# EAGLE schematic Entrance v0.2 (EAGLE 9.6.2)
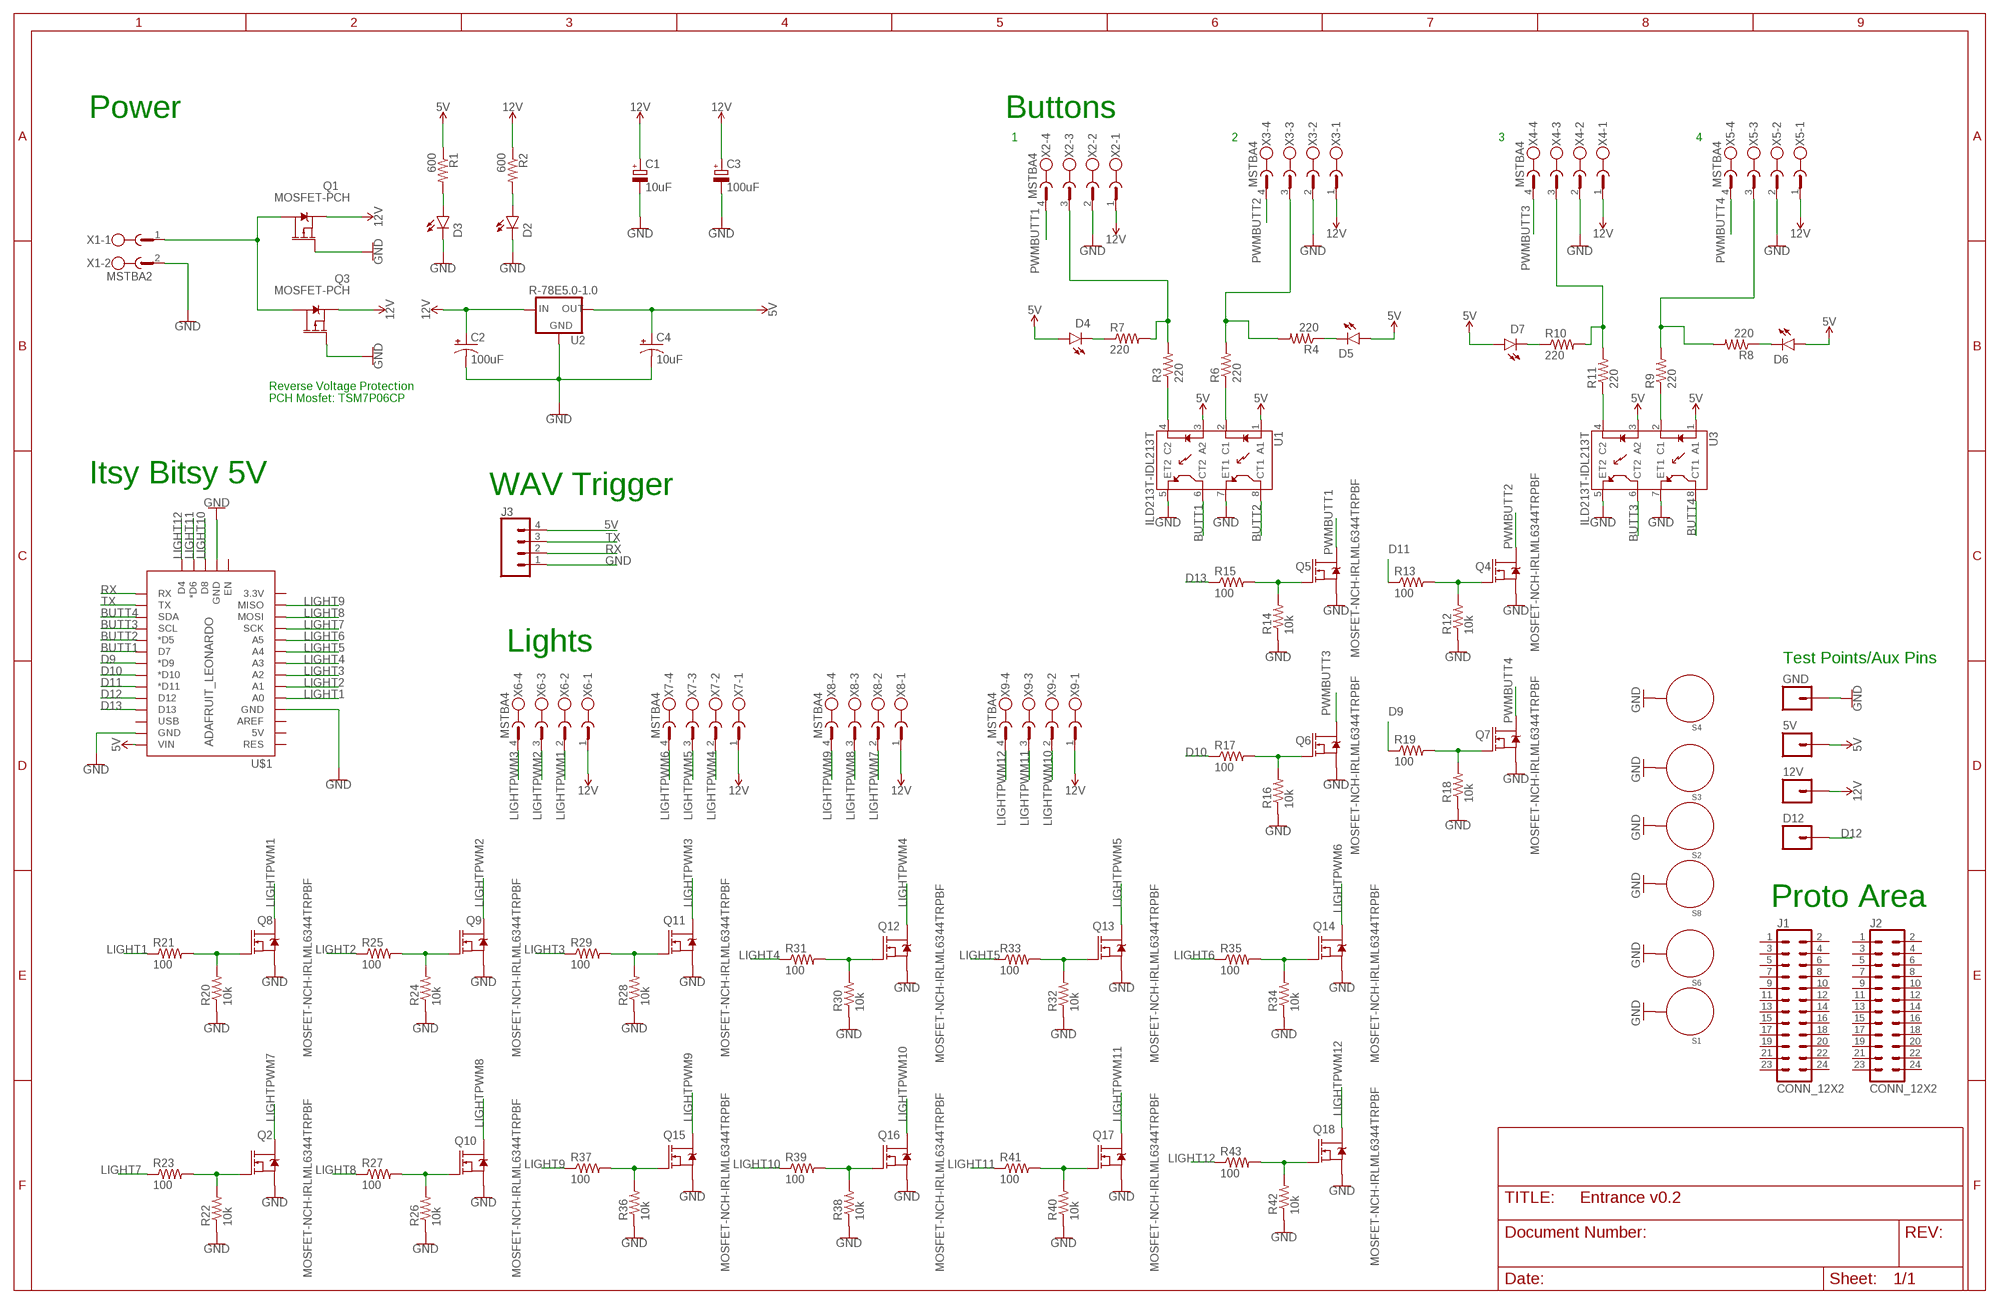
[diagram p0: schematic, sheet 1]

## Parts
5V  M01PTH  [1X01]
12V  M01PTH  [1X01]
C1  10uF  CPOL-EUE2-5  [E2-5]
C2  100uF  100UF-POLAR-RADIAL-2.5MM-25V-20%  [CPOL-RADIAL-2.5MM-6.5MM]
C3  100uF  CPOL-EUE3.5-10  [E3,5-10]
C4  10uF  10UF-POLAR-RADIAL-2.5MM-KIT-25V-20%  [CPOL-RADIAL-2.5MM-5MM-KIT]
D2  RED  SPARKFUN-LED_LED1206  [SPARKFUN-LED_LED-1206]
D3  RED  SPARKFUN-LED_LED1206  [SPARKFUN-LED_LED-1206]
D4  RED  LED-RED1206  [LED-1206]
D5  RED  LED-RED1206  [LED-1206]
D6  RED  LED-RED1206  [LED-1206]
D7  RED  LED-RED1206  [LED-1206]
D12  M01PTH  [1X01]
GND  M01PTH  [1X01]
J1  CONN_12X2  [2X12]
J2  CONN_12X2  [2X12]
J3  CONN_043.5MM_RA  [1X04_3.5MM_RA]
Q1  MOSFET-PCH  [DPAK@1]
Q2  MOSFET-NCH-IRLML6344TRPBF  [SOT23-3]
Q3  MOSFET-PCH  [DPAK@1]
Q4  MOSFET-NCH-IRLML6344TRPBF  [SOT23-3]
Q5  MOSFET-NCH-IRLML6344TRPBF  [SOT23-3]
Q6  MOSFET-NCH-IRLML6344TRPBF  [SOT23-3]
Q7  MOSFET-NCH-IRLML6344TRPBF  [SOT23-3]
Q8  MOSFET-NCH-IRLML6344TRPBF  [SOT23-3]
Q9  MOSFET-NCH-IRLML6344TRPBF  [SOT23-3]
Q10  MOSFET-NCH-IRLML6344TRPBF  [SOT23-3]
Q11  MOSFET-NCH-IRLML6344TRPBF  [SOT23-3]
Q12  MOSFET-NCH-IRLML6344TRPBF  [SOT23-3]
Q13  MOSFET-NCH-IRLML6344TRPBF  [SOT23-3]
Q14  MOSFET-NCH-IRLML6344TRPBF  [SOT23-3]
Q15  MOSFET-NCH-IRLML6344TRPBF  [SOT23-3]
Q16  MOSFET-NCH-IRLML6344TRPBF  [SOT23-3]
Q17  MOSFET-NCH-IRLML6344TRPBF  [SOT23-3]
Q18  MOSFET-NCH-IRLML6344TRPBF  [SOT23-3]
R1  600  R-US_R0805  [R0805]
R2  600  R-US_R0805  [R0805]
R3  220  R-US_R0805  [R0805]
R4  220  R-US_R0805  [R0805]
R6  220  R-US_R0805  [R0805]
R7  220  R-US_R0805  [R0805]
R8  220  R-US_R0805  [R0805]
R9  220  R-US_R0805  [R0805]
R10  220  R-US_R0805  [R0805]
R11  220  R-US_R0805  [R0805]
R12  10k  R-US_R0805  [R0805]
R13  100  R-US_R0805  [R0805]
R14  10k  R-US_R0805  [R0805]
R15  100  R-US_R0805  [R0805]
R16  10k  R-US_R0805  [R0805]
R17  100  R-US_R0805  [R0805]
R18  10k  R-US_R0805  [R0805]
R19  100  R-US_R0805  [R0805]
R20  10k  R-US_R0805  [R0805]
R21  100  R-US_R0805  [R0805]
R22  10k  R-US_R0805  [R0805]
R23  100  R-US_R0805  [R0805]
R24  10k  R-US_R0805  [R0805]
R25  100  R-US_R0805  [R0805]
R26  10k  R-US_R0805  [R0805]
R27  100  R-US_R0805  [R0805]
R28  10k  R-US_R0805  [R0805]
R29  100  R-US_R0805  [R0805]
R30  10k  R-US_R0805  [R0805]
R31  100  R-US_R0805  [R0805]
R32  10k  R-US_R0805  [R0805]
R33  100  R-US_R0805  [R0805]
R34  10k  R-US_R0805  [R0805]
R35  100  R-US_R0805  [R0805]
R36  10k  R-US_R0805  [R0805]
R37  100  R-US_R0805  [R0805]
R38  10k  R-US_R0805  [R0805]
R39  100  R-US_R0805  [R0805]
R40  10k  R-US_R0805  [R0805]
R41  100  R-US_R0805  [R0805]
R42  10k  R-US_R0805  [R0805]
R43  100  R-US_R0805  [R0805]
S1  STANDOFF_ELECTRICAL5-32  [STANDOFF_ELECTRICAL_5_32]
S2  STANDOFF_ELECTRICAL5-32  [STANDOFF_ELECTRICAL_5_32]
S3  STANDOFF_ELECTRICAL5-32  [STANDOFF_ELECTRICAL_5_32]
S4  STANDOFF_ELECTRICAL5-32  [STANDOFF_ELECTRICAL_5_32]
S6  STANDOFF_ELECTRICAL5-32  [STANDOFF_ELECTRICAL_5_32]
S8  STANDOFF_ELECTRICAL5-32  [STANDOFF_ELECTRICAL_5_32]
U1  ILD213T-IDL213T  [SO08@1]
U2  R-78E5.0-1.0  [DC-DC_CONVERTER_78XX]
U3  ILD213T-IDL213T  [SO08@1]
U$1  ADAFRUIT_LEONARDO  [ADAFRUIT_LENOARDO]
X1  MSTBA2  [MSTBA2]
X2  MSTBA4  [MSTBA4]
X3  MSTBA4  [MSTBA4]
X4  MSTBA4  [MSTBA4]
X5  MSTBA4  [MSTBA4]
X6  MSTBA4  [MSTBA4]
X7  MSTBA4  [MSTBA4]
X8  MSTBA4  [MSTBA4]
X9  MSTBA4  [MSTBA4]

## Nets
5V: 5V.1 C4.1(+) D4.A D5.A D6.A D7.A J3.4 R1.1 U1.1(A1) U1.3(A2) U2.VOUT(OUT) U3.1(A1) U3.3(A2) U$1.VIN
12V: 12V.1 C1.+ C2.1(+) C3.+ Q1.3(S) Q3.3(S) R2.1 U2.VIN(IN) X2.1 X3.1 X4.1 X5.1 X6.1 X7.1 X8.1 X9.1
BUTT1: U1.6(CT2) U$1.D7
BUTT2: U1.8(CT1) U$1.D5(*D5)
BUTT3: U3.6(CT2) U$1.SCL
BUTT4: U3.8(CT1) U$1.SDA
D9: R19.1 U$1.D9(*D9)
D10: R17.1 U$1.D10(*D10)
D11: R13.1 U$1.D11(*D11)
D12: D12.1 U$1.D12
D13: R15.1 U$1.D13
GND: C1.- C2.2(-) C3.- C4.2(-) D2.C D3.C GND.1 J3.1 Q1.1(G) Q2.2(S) Q3.1(G) Q4.2(S) Q5.2(S) Q6.2(S) Q7.2(S) Q8.2(S) Q9.2(S) Q10.2(S) Q11.2(S) Q12.2(S) Q13.2(S) Q14.2(S) Q15.2(S) Q16.2(S) Q17.2(S) Q18.2(S) R12.1 R14.1 R16.1 R18.1 R20.1 R22.1 R24.1 R26.1 R28.1 R30.1 R32.1 R34.1 R36.1 R38.1 R40.1 R42.1 S1.P1 S2.P1 S3.P1 S4.P1 S6.P1 S8.P1 U1.5(ET2) U1.7(ET1) U2.GND U3.5(ET2) U3.7(ET1) U$1.GND@0(GND) U$1.GND@1(GND) U$1.GND@2(GND) X1.2 X2.2 X3.2 X4.2 X5.2
LIGHT1: R21.1 U$1.A0
LIGHT2: R25.1 U$1.A1
LIGHT3: R29.1 U$1.A2
LIGHT4: R31.1 U$1.A3
LIGHT5: R33.1 U$1.A4
LIGHT6: R35.1 U$1.A5
LIGHT7: R23.1 U$1.SCK
LIGHT8: R27.1 U$1.MOSI
LIGHT9: R37.1 U$1.MISO
LIGHT10: R39.1 U$1.D8
LIGHT11: R41.1 U$1.D6(*D6)
LIGHT12: R43.1 U$1.D4
LIGHTPWM1: Q8.3(D) X6.2
LIGHTPWM2: Q9.3(D) X6.3
LIGHTPWM3: Q11.3(D) X6.4
LIGHTPWM4: Q12.3(D) X7.2
LIGHTPWM5: Q13.3(D) X7.3
LIGHTPWM6: Q14.3(D) X7.4
LIGHTPWM7: Q2.3(D) X8.2
LIGHTPWM8: Q10.3(D) X8.3
LIGHTPWM9: Q15.3(D) X8.4
LIGHTPWM10: Q16.3(D) X9.2
LIGHTPWM11: Q17.3(D) X9.3
LIGHTPWM12: Q18.3(D) X9.4
N$1: R3.1 U1.4(C2)
N$3: D2.A R2.2
N$4: D6.C R8.1
N$5: D3.A R1.2
N$6: D4.C R7.1
N$7: D5.C R4.1
N$8: R3.2 R7.2 X2.3
N$9: R6.1 U1.2(C1)
N$10: R4.2 R6.2 X3.3
N$11: R9.1 U3.2(C1)
N$12: R8.2 R9.2 X5.3
N$13: D7.C R10.1
N$14: R10.2 R11.2 X4.3
N$15: R11.1 U3.4(C2)
N$16: Q5.1(G) R14.2 R15.2
N$17: Q6.1(G) R16.2 R17.2
N$18: Q7.1(G) R18.2 R19.2
N$19: Q1.4(D) Q3.4(D) X1.1
N$20: Q8.1(G) R20.2 R21.2
N$21: Q2.1(G) R22.2 R23.2
N$22: Q9.1(G) R24.2 R25.2
N$23: Q10.1(G) R26.2 R27.2
N$24: Q11.1(G) R28.2 R29.2
N$25: Q4.1(G) R12.2 R13.2
N$26: Q12.1(G) R30.2 R31.2
N$27: Q13.1(G) R32.2 R33.2
N$28: Q14.1(G) R34.2 R35.2
N$29: Q15.1(G) R36.2 R37.2
N$30: Q16.1(G) R38.2 R39.2
N$31: Q17.1(G) R40.2 R41.2
N$32: Q18.1(G) R42.2 R43.2
PWMBUTT1: Q5.3(D) X2.4
PWMBUTT2: Q4.3(D) X3.4
PWMBUTT3: Q6.3(D) X4.4
PWMBUTT4: Q7.3(D) X5.4
RX: J3.2 U$1.RX
TX: J3.3 U$1.TX
Unconnected: J1.1 J1.2 J1.3 J1.4 J1.5 J1.6 J1.7 J1.8 J1.9 J1.10 J1.11 J1.12 J1.13 J1.14 J1.15 J1.16 J1.17 J1.18 J1.19 J1.20 J1.21 J1.22 J1.23 J1.24 J2.1 J2.2 J2.3 J2.4 J2.5 J2.6 J2.7 J2.8 J2.9 J2.10 J2.11 J2.12 J2.13 J2.14 J2.15 J2.16 J2.17 J2.18 J2.19 J2.20 J2.21 J2.22 J2.23 J2.24 U$1.3V(3.3V) U$1.5V U$1.AREF U$1.EN U$1.RES U$1.USB

## Notes on the sheet
- Power | Buttons
- 1 | 2 | 3 | 4
- Reverse Voltage Protection
  PCH Mosfet: TSM7P06CP
- Itsy Bitsy 5V
- WAV Trigger
- Lights
- Test Points/Aux Pins
- Proto Area

## Library data of the parts
5V 12V D12 GND = SparkFun-Connectors:M01: Header 1 Standard 1-pin 0.1" header. Use with straight break away headers (SKU : PRT-00116), right angle break away headers (PRT-00553), swiss pins (PRT-00743), machine pins (PRT-00117), and female headers (PRT-00115). SMTSO-256-ET is a "flush mount" nut for a 4-40 screw. The older package used to be too tight, and did not allow it to sit properly thru the drill hit. The latest (0.165DIA) fits nice and snug.
C1 C3 = rcl:CPOL-EU: POLARIZED CAPACITOR, European symbol; SPICEPREFIX: C
C2 = SparkFun-Capacitors:100UF-POLAR: 100µF polarized capacitors A capacitor is a passive two-terminal electrical component used to store electrical energy temporarily in an electric field.; PROD_ID: CAP-08439
C4 = SparkFun-Capacitors:10UF-POLAR: 10.0µF polarized capacitors A capacitor is a passive two-terminal electrical component used to store electrical energy temporarily in an electric field.; PROD_ID: CAP-08440
D2 D3 = th_libraries:SPARKFUN-LED_LED: LED (Generic) Standard schematic elements and footprints for 5mm, 3mm, 1206, and 0603 sized LEDs. Generic LEDs with no color specified.
D4-D7 = SparkFun-LED:LED-RED: Red SMD LED Used in manufacturing of most products at SparkFun Packages: 0603 - SMD 0603 package [Product Link] <http://docs.avagotech.com/docs/AV02-0551EN> 0603 SMART - SMD 0603 SMART package ( more efficient and expensive)[Product Link] <http://www.osram-os.com/Graphics/XPic2/00077099_0.pdf> 1206 - SMD1206 package [Product Link] <https://www.sparkfun.com/datasheets/DevTools/LilyPad/Q150OVS4.pdff> SparkFun Products: Pro Mini 328 -5V <https://www.sparkfun.com/products/821> RedBoard <https://www.sparkfun.com/products/12757> IOIO-OTG <https://www.sparkfun.com/products/13613>; PROD_ID: DIO-09912
J1 J2 = SparkFun-Connectors:CONN_12X2: Multi connection point. Often used as Generic Header-pin footprint for 0.1 inch spaced/style header connections On any of the 0.1 inch spaced packages, you can populate with these: Break Away Headers - Straight <https://www.sparkfun.com/products/116> (PRT-00116) Break Away Male Headers - Right Angle <https://www.sparkfun.com/products/553> (PRT-00553) Female Headers <https://www.sparkfun.com/products/115> (PRT-00115) Break Away Headers - Machine Pin <https://www.sparkfun.com/products/117> (PRT-00117) Break Away Female Headers - Swiss Machine Pin <https://www.sparkfun.com/products/743> (PRT-00743)
J3 = th_libraries:CONN_04: Multi connection point. Often used as Generic Header-pin footprint for 0.1 inch spaced/style header connections On any of the 0.1 inch spaced packages, you can populate with these: Break Away Headers - Straight <https://www.sparkfun.com/products/116> (PRT-00116) Break Away Male Headers - Right Angle <https://www.sparkfun.com/products/553> (PRT-00553) Female Headers <https://www.sparkfun.com/products/115> (PRT-00115) Break Away Headers - Machine Pin <https://www.sparkfun.com/products/117> (PRT-00117) Break Away Female Headers - Swiss Machine Pin <https://www.sparkfun.com/products/743> (PRT-00743) For SCREWTERMINALS and SPRING TERMINALS visit here: Screw Terimnals on SparkFun.com <https://www.sparkfun.com/search/results?term=Screw+Terminals> (5mm/3.5mm/2.54mm spacing) This device is also useful as a general connection point to wire up your design to another part of your project. Our various solder wires solder well into these plated through hole pads. Hook-Up Wire - Assortment (Stranded, 22 AWG) <https://www.sparkfun.com/products/11375> (PRT-11375) Hook-Up Wire - Assortment (Solid Core, 22 AWG) <https://www.sparkfun.com/products/11367> (PRT-11367) View the entire wire category on our website here <https://www.sparkfun.com/categories/141> Special notes: Molex polarized connector foot print use with SKU : PRT-08231 with associated crimp pins and housings. 1MM SMD Version SKU: PRT-10208
Q1 Q3 = th_libraries:MOSFET-PCH: MOSFET-PCH
Q2 Q4-Q18 = th_libraries:MOSFET-NCH: N-channel MOSFETs from Sparkfun-DiscreteSemi Library; DESC: 5.0A/29mOhm/30V/2.5V drv capable
R1-R4 R6-R43 = rcl:R-US_: RESISTOR, American symbol; SPICEPREFIX: R
S1-S4 S6 S8 = th_libraries:STANDOFF_ELECTRICAL: A standoff intended to be an electrically connected point. Pad size and stop size allow for a #8 Phillips pan screw head to make a solid connection to the board. Added 144mill drill hole that fits my normal wood screw
U1 U3 = th_libraries:ILD213T: Dual Channel Phototransistor Optocoupler Dual Channel 70 V 4000 Vrms Phototransistor Optocoupler in a standard SOIC-8 package. Used to couple signals between electrically isolated circuits. Datasheet <https://www.sparkfun.com/datasheets/Components/SMD/ild205t.pdf> SparkFun Products: SparkFun Opto-Isolator Breakout <https://www.sparkfun.com/products/9118>; PROD_ID: IC-09076
U2 = SparkFun-IC-Power:R-78E5.0-1.0: Recom Power 5V 1A DC/DC Converter The Recom R-78E5.0-X.X is a compact DC/DC converter module that is a pin for pin drop-in replacement for the LM7805 linear voltage regulator. Specifications: Input Range: 7-28V Output Voltage: 5V Output Current: 1A Max Efficiency: 91% Datasheet <https://www.recom-power.com/pdf/Innoline/R-78Exx-1.0.pdf>; PROD_ID: COM-13655
U$1 = th_libraries:ADAFRUIT_LEONARDO: Adafruit ItsyBitsy 32u4 - 5V 16MHz https://www.adafruit.com/product/3677
X1 = con-phoenix-508:MSTBA2: PHOENIX; MF: FARNELL; MPN: 1757242; OC_FARNELL: 3705171; OC_NEWARK: 71C4161
X2-X9 = con-phoenix-508:MSTBA4: PHOENIX; MF: FARNELL; MPN: 1757268; OC_FARNELL: 3705195; OC_NEWARK: 71C4163